# EAGLE design BioSignalPi-VersionA (EAGLE 7.2.0)
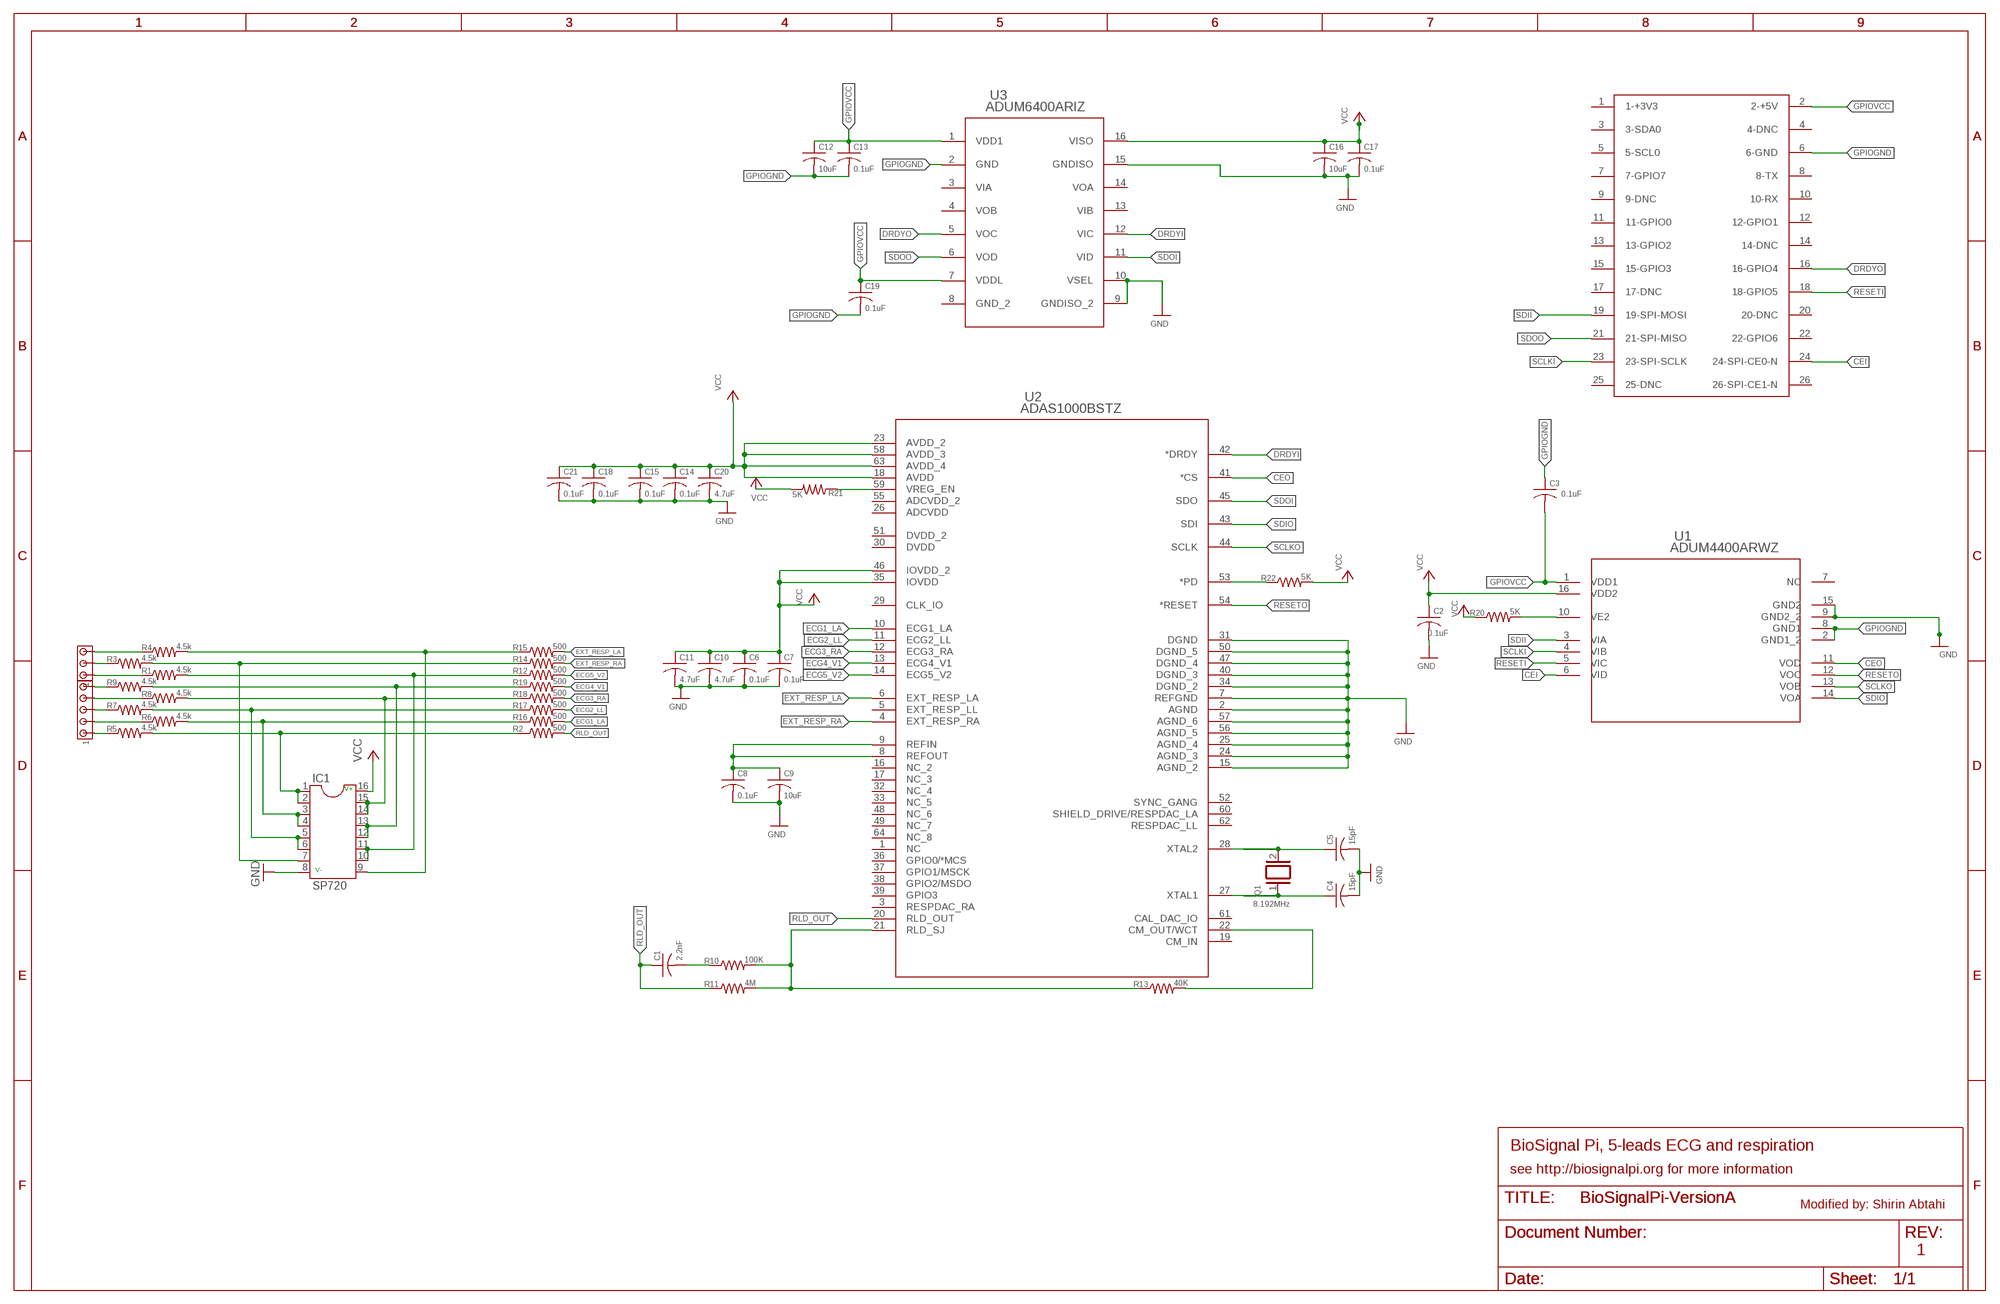
[diagram p0: schematic, sheet 1]

## Parts
C1  2.2nF  C-USC0805  [C0805]
C2  0.1uF  C-USC0805  [C0805]
C3  0.1uF  C-USC0805  [C0805]
C4  15pF  C-USC0805  [C0805]
C5  15pF  C-USC0805  [C0805]
C6  0.1uF  C-USC0805  [C0805]
C7  0.1uF  C-USC0805  [C0805]
C8  0.1uF  C-USC0805  [C0805]
C9  10uF  C-USC0805  [C0805]
C10  4.7uF  C-USC0805  [C0805]
C11  4.7uF  C-USC0805  [C0805]
C12  10uF  C-USC0805  [C0805]
C13  0.1uF  C-USC0805  [C0805]
C14  0.1uF  C-USC0805  [C0805]
C15  0.1uF  C-USC0805  [C0805]
C16  10uF  C-USC0805  [C0805]
C17  0.1uF  C-USC0805  [C0805]
C18  0.1uF  C-USC0805  [C0805]
C19  0.1uF  C-USC0805  [C0805]
C20  4.7uF  C-USC0805  [C0805]
C21  0.1uF  C-USC0805  [C0805]
IC1  SP720  DIL16  [DIL16]
J1  JUMPERS  MTA03-100  [10X03MTA]
J2  JUMPERS  MTA05-100  [10X05MTA]
Q1  8.192MHz  XTAL/S  [QS]
R1  4.5k  R-US_R0805  [R0805]
R2  500  R-US_R0805  [R0805]
R3  4.5k  R-US_R0805  [R0805]
R4  4.5k  R-US_R0805  [R0805]
R5  4.5k  R-US_R0805  [R0805]
R6  4.5k  R-US_R0805  [R0805]
R7  4.5k  R-US_R0805  [R0805]
R8  4.5k  R-US_R0805  [R0805]
R9  4.5k  R-US_R0805  [R0805]
R10  100K  R-US_R0805  [R0805]
R11  4M  R-US_R0805  [R0805]
R12  500  R-US_R0805  [R0805]
R13  40K  R-US_R0805  [R0805]
R14  500  R-US_R0805  [R0805]
R15  500  R-US_R0805  [R0805]
R16  500  R-US_R0805  [R0805]
R17  500  R-US_R0805  [R0805]
R18  500  R-US_R0805  [R0805]
R19  500  R-US_R0805  [R0805]
R20  5K  R-US_R0805  [R0805]
R21  5K  R-US_R0805  [R0805]
R22  5K  R-US_R0805  [R0805]
U1  ADUM4400ARWZ  [RW_16]
U2  ADAS1000BSTZ  [ST_64_2]
U3  ADUM6400ARIZ  [RI_16_1]
U$1  RASPBERRY-PI  [RASPBERRY-PI]

## Nets
CEI: U1.6(VID) U$1.24(24-SPI-CE0-N)
CEO: U1.11(VOD) U2.41(*CS)
DRDYI: U2.42(*DRDY) U3.12(VIC)
DRDYO: U3.5(VOC) U$1.16(16-GPIO4)
ECG1_LA: R16.2 U2.10(ECG1_LA)
ECG2_LL: R17.2 U2.11(ECG2_LL)
ECG3_RA: R18.2 U2.12(ECG3_RA)
ECG4_V1: R19.2 U2.13(ECG4_V1)
ECG5_V2: R12.2 U2.14(ECG5_V2)
EXT_RESP_LA: R15.2 U2.6(EXT_RESP_LA)
EXT_RESP_RA: R14.2 U2.4(EXT_RESP_RA)
GND: C2.2 C4.2 C5.2 C6.2 C7.2 C8.2 C9.2 C10.2 C11.2 C14.2 C15.2 C16.2 C17.2 C18.2 C20.2 C21.2 IC1.8 U1.9(GND2_2) U1.15(GND2) U2.2(AGND) U2.7(REFGND) U2.15(AGND_2) U2.24(AGND_3) U2.25(AGND_4) U2.31(DGND) U2.34(DGND_2) U2.40(DGND_3) U2.47(DGND_4) U2.50(DGND_5) U2.56(AGND_5) U2.57(AGND_6) U3.9(GNDISO_2) U3.10(VSEL) U3.15(GNDISO)
GPIOGND: C3.1 C12.2 C13.2 C19.2 U1.2(GND1_2) U1.8(GND1) U3.2(GND) U$1.6(6-GND)
GPIOVCC: C3.2 C12.1 C13.1 C19.1 U1.1(VDD1) U3.1(VDD1) U3.7(VDDL) U$1.2(2-+5V)
JUMPERS: J1.1 R1.1
N$1: J2.1 R5.1
N$2: J2.2 R6.1
N$3: J2.3 R7.1
N$4: J2.4 R8.1
N$5: J2.5 R9.1
N$7: J1.2 R3.1
N$8: J1.3 R4.1
N$9: IC1.9 R4.2 R15.1
N$10: IC1.7 R3.2 R14.1
N$11: C5.1 Q1.2 U2.28(XTAL2)
N$12: C4.1 Q1.1 U2.27(XTAL1)
N$13: R10.2 R11.2 R13.1 U2.21(RLD_SJ)
N$14: IC1.1 IC1.2 R2.1 R5.2
N$15: IC1.14 IC1.15 R8.2 R18.1
N$16: IC1.12 IC1.13 R9.2 R19.1
N$17: IC1.3 IC1.4 R6.2 R16.1
N$18: IC1.5 IC1.6 R7.2 R17.1
N$19: IC1.10 IC1.11 R1.2 R12.1
N$21: R20.2 U1.10(VE2)
N$23: R22.1 U2.53(*PD)
N$25: R13.2 U2.22(CM_OUT/WCT)
N$26: C1.2 R10.1
N$29: R21.1 U2.59(VREG_EN)
N$36: C8.1 C9.1 U2.8(REFOUT) U2.9(REFIN)
RESETI: U1.5(VIC) U$1.18(18-GPIO5)
RESETO: U1.12(VOC) U2.54(*RESET)
RLD_OUT: C1.1 R2.2 R11.1 U2.20(RLD_OUT)
SCLKI: U1.4(VIB) U$1.23(23-SPI-SCLK)
SCLKO: U1.13(VOB) U2.44(SCLK)
SDII: U1.3(VIA) U$1.19(19-SPI-MOSI)
SDIO: U1.14(VOA) U2.43(SDI)
SDOI: U2.45(SDO) U3.11(VID)
SDOO: U3.6(VOD) U$1.21(21-SPI-MISO)
VCC: C2.1 C6.1 C7.1 C10.1 C11.1 C14.1 C15.1 C16.1 C17.1 C18.1 C20.1 C21.1 IC1.16 R20.1 R21.2 R22.2 U1.16(VDD2) U2.18(AVDD) U2.23(AVDD_2) U2.35(IOVDD) U2.46(IOVDD_2) U2.58(AVDD_3) U2.63(AVDD_4) U3.16(VISO)
Unconnected: U1.7(NC) U2.1(NC) U2.3(RESPDAC_RA) U2.5(EXT_RESP_LL) U2.16(NC_2) U2.17(NC_3) U2.19(CM_IN) U2.26(ADCVDD) U2.29(CLK_IO) U2.30(DVDD) U2.32(NC_4) U2.33(NC_5) U2.36(GPIO0/*MCS) U2.37(GPIO1/MSCK) U2.38(GPIO2/MSDO) U2.39(GPIO3) U2.48(NC_6) U2.49(NC_7) U2.51(DVDD_2) U2.52(SYNC_GANG) U2.55(ADCVDD_2) U2.60(SHIELD_DRIVE/RESPDAC_LA) U2.61(CAL_DAC_IO) U2.62(RESPDAC_LL) U2.64(NC_8) U3.3(VIA) U3.4(VOB) U3.8(GND_2) U3.13(VIB) U3.14(VOA) U$1.1(1-+3V3) U$1.3(3-SDA0) U$1.4(4-DNC) U$1.5(5-SCL0) U$1.7(7-GPIO7) U$1.8(8-TX) U$1.9(9-DNC) U$1.10(10-RX) U$1.11(11-GPIO0) U$1.12(12-GPIO1) U$1.13(13-GPIO2) U$1.14(14-DNC) U$1.15(15-GPIO3) U$1.17(17-DNC) U$1.20(20-DNC) U$1.22(22-GPIO6) U$1.25(25-DNC) U$1.26(26-SPI-CE1-N)

## Notes on the sheet
- V+
- V-
- BioSignal Pi, 5-leads ECG and respiration
- see http://biosignalpi.org for more information
- Modified by: Shirin Abtahi
- 1

## Library data of the parts
C1-C21 = rcl:C-US: CAPACITOR, American symbol
IC1 = ic-packageEdit:DIL16: Dual In Line / Socket
J1 = con-amp:MTA03-100: AMP connector
J2 = con-amp:MTA05-100: AMP connector
Q1 = special:XTAL/S: CRYSTAL
R1-R22 = adafruit:R-US_: RESISTOR, American symbol
U1 = ADUM4400:ADUM4400ARWZ
U2 = ADAS1000:ADAS1000BSTZ
U3 = adum6403:ADUM6400ARIZ
U$1 = RaspberryPiEdit:RASPBERRY-PI: Raspberry Pi Board <http://www.raspberrypi.org/> Jacques Lagnel V1.0 (beta) 2012 Board dimension: Forum 3D model <http://www.raspberrypi.org/forum/general-discussion/mechanical-profile-3d-models?value=3d%20model&type=1&include=1&search=1&ret=all> The GPIO Connector (P1): http://elinux.org/RPi_Low-level_peripherals

## Board
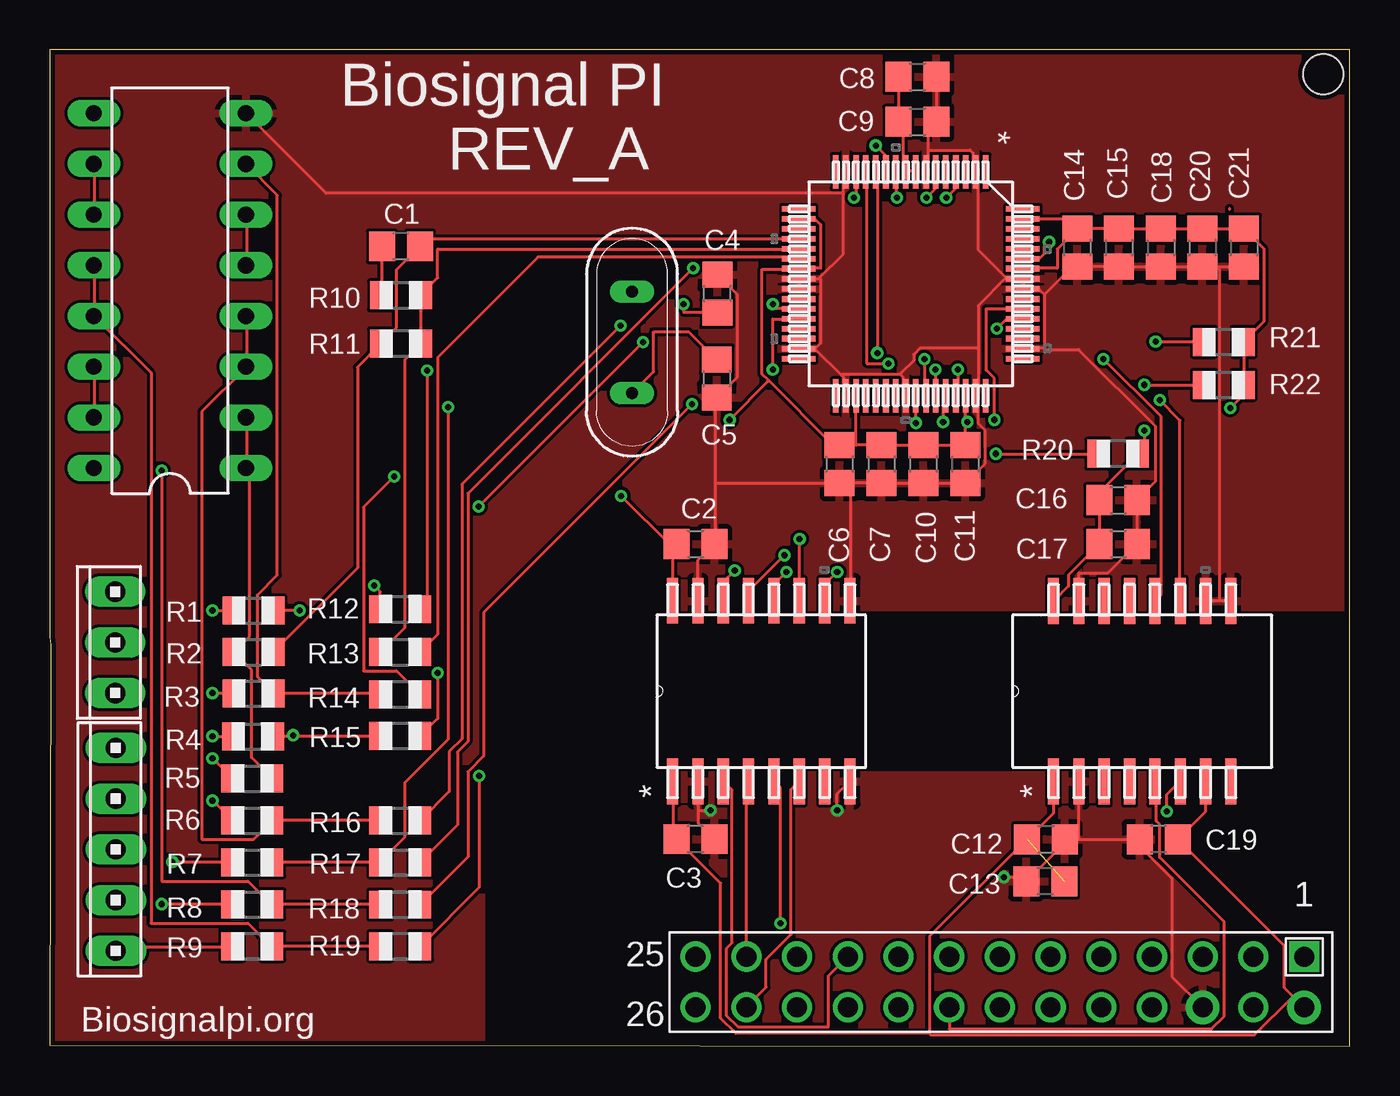
[diagram p1: board, top side]
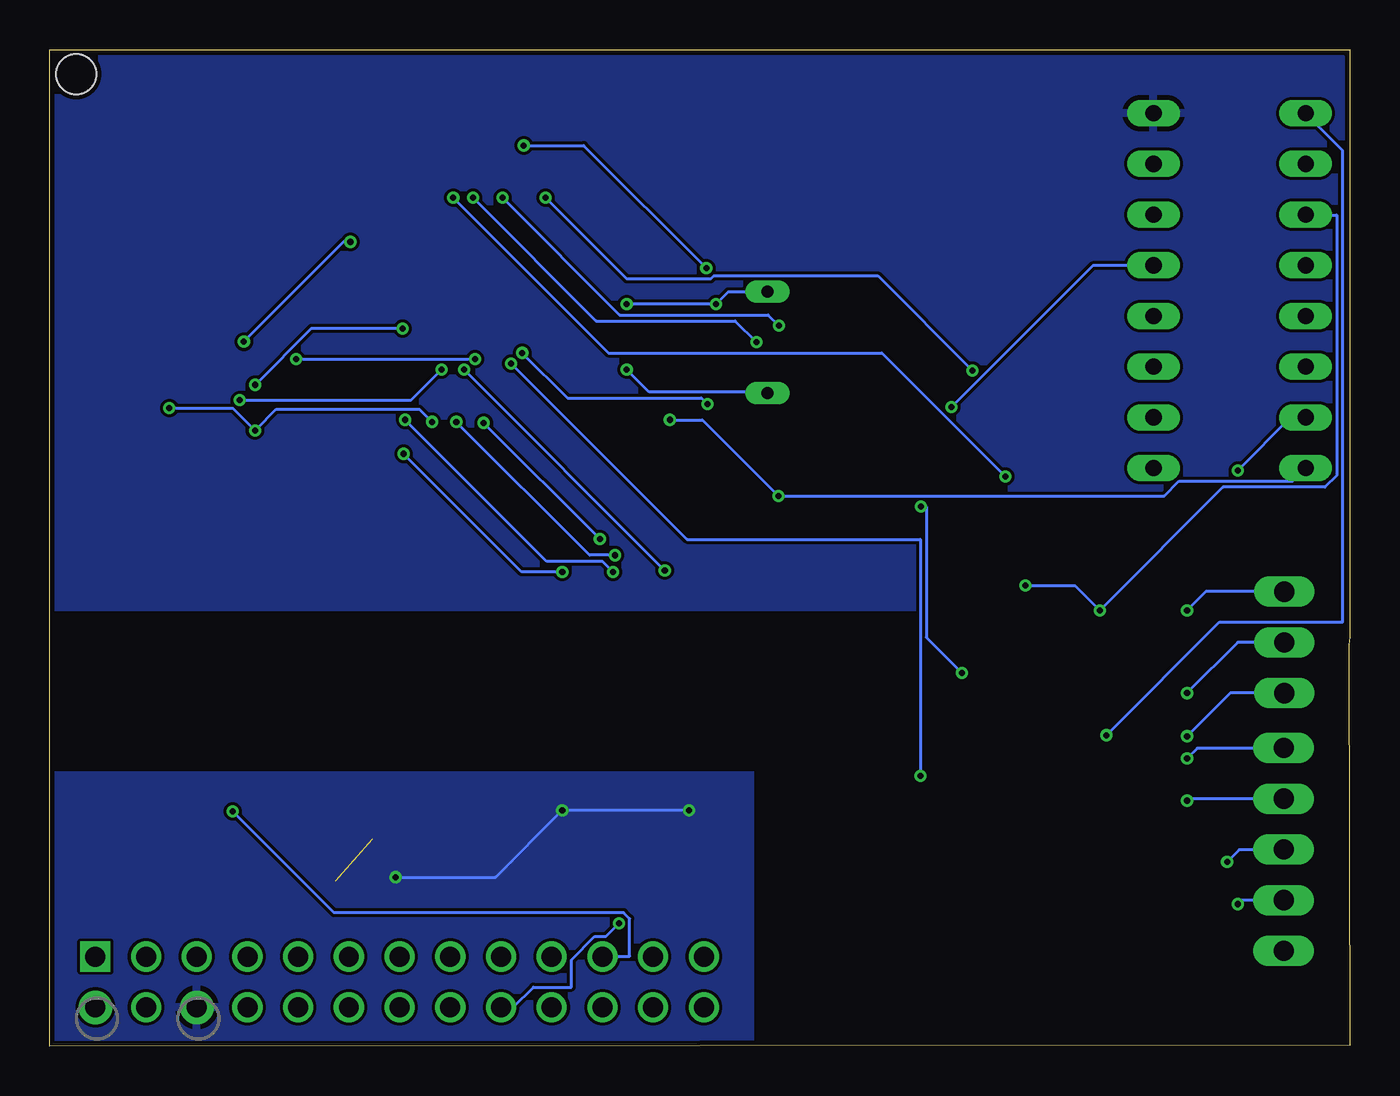
[diagram p2: board, bottom side, seen from below]

Size 65.1 x 49.9 mm. Coordinates in mm from the lower left corner, seen from the top.
Outline: 0,0.03 65.1,0 65.1,49.9 0,49.9 0,20.5 0.04,20.09 0,0.03
Copper layers (1*16): Top 0.035mm / dielectric 1.5mm / Bottom 0.035mm
Design rules "ITEADstudio_DRC": minimum track width 6mil, minimum drill 12mil, track to track 6mil, track to pad 6mil, pad to pad 6mil, via to via 6mil, smd to smd 0mil, copper to edge 10mil, drill to drill 10mil, minimum pad ring 10mil, minimum via ring 6mil, stop-mask expansion 2mil, vias tented up to drill 100mil, thermal gap 10mil
Holes 2 mm at 63.78,48.69
tRestrict: area 22,14 to 65.4,21.6; area 22,0 to 29.6,14
bRestrict: area 22,14 to 65.2,21.6; area 22,0 to 29.6,14

### Footprints (pad centres in the part's own frame; a part is rotated, then mirrored left to right if it is on the bottom)
C0805 = smd 1.3 x 1.5: 1 -0.95,0; 2 0.95,0
DIL16 = drill 0.813 long: 1 -8.89,-3.81; 2 -6.35,-3.81; 3 -3.81,-3.81; 4 -1.27,-3.81; 5 1.27,-3.81; 6 3.81,-3.81; 7 6.35,-3.81; 8 8.89,-3.81; 9 8.89,3.81; 10 6.35,3.81; 11 3.81,3.81; 12 1.27,3.81; 13 -1.27,3.81; 14 -3.81,3.81; 15 -6.35,3.81; 16 -8.89,3.81
10X03MTA = drill 1.016 long: 1 2.54,0; 2 0,0; 3 -2.54,0
10X05MTA = drill 1.016 long: 1 5.08,0; 2 2.54,0; 3 0,0; 4 -2.54,0; 5 -5.08,0
QS = drill 0.61 long: 1 -2.54,0; 2 2.54,0
R0805 = smd 1.1 x 1.4: 1 -1,0; 2 1,0
RW_16 = smd 2.286 x 0.559: 1 -4.521,4.445; 2 -4.521,3.175; 3 -4.521,1.905; 4 -4.521,0.635; 5 -4.521,-0.635; 6 -4.521,-1.905; 7 -4.521,-3.175; 8 -4.521,-4.445; 9 4.521,-4.445; 10 4.521,-3.175; 11 4.521,-1.905; 12 4.521,-0.635; 13 4.521,0.635; 14 4.521,1.905; 15 4.521,3.175; 16 4.521,4.445
ST_64_2 = smd 1.676 x 0.279: 1 -5.613,3.759; 2 -5.613,3.251; 3 -5.613,2.743; 4 -5.613,2.261; 5 -5.613,1.753; 6 -5.613,1.245; 7 -5.613,0.762; 8 -5.613,0.254; 9 -5.613,-0.254; 10 -5.613,-0.762; 11 -5.613,-1.245; 12 -5.613,-1.753; 13 -5.613,-2.261; 14 -5.613,-2.743; 15 -5.613,-3.251; 16 -5.613,-3.759; 33 5.613,-3.759; 34 5.613,-3.251; 35 5.613,-2.743; 36 5.613,-2.261; 37 5.613,-1.753; 38 5.613,-1.245; 39 5.613,-0.762; 40 5.613,-0.254; 41 5.613,0.254; 42 5.613,0.762; 43 5.613,1.245; 44 5.613,1.753; 45 5.613,2.261; 46 5.613,2.743; 47 5.613,3.251; 48 5.613,3.759 | smd 0.279 x 1.676: 17 -3.759,-5.613; 18 -3.251,-5.613; 19 -2.743,-5.613; 20 -2.261,-5.613; 21 -1.753,-5.613; 22 -1.245,-5.613; 23 -0.762,-5.613; 24 -0.254,-5.613; 25 0.254,-5.613; 26 0.762,-5.613; 27 1.245,-5.613; 28 1.753,-5.613; 29 2.261,-5.613; 30 2.743,-5.613; 31 3.251,-5.613; 32 3.759,-5.613; 49 3.759,5.613; 50 3.251,5.613; 51 2.743,5.613; 52 2.261,5.613; 53 1.753,5.613; 54 1.245,5.613; 55 0.762,5.613; 56 0.254,5.613; 57 -0.254,5.613; 58 -0.762,5.613; 59 -1.245,5.613; 60 -1.753,5.613; 61 -2.261,5.613; 62 -2.743,5.613; 63 -3.251,5.613; 64 -3.759,5.613
RI_16_1 = smd 2.311 x 0.559: 1 -4.521,4.445; 2 -4.521,3.175; 3 -4.521,1.905; 4 -4.521,0.635; 5 -4.521,-0.635; 6 -4.521,-1.905; 7 -4.521,-3.175; 8 -4.521,-4.445; 9 4.521,-4.445; 10 4.521,-3.175; 11 4.521,-1.905; 12 4.521,-0.635; 13 4.521,0.635; 14 4.521,1.905; 15 4.521,3.175; 16 4.521,4.445
RASPBERRY-PI = drill 1 square: 1 0,0 | drill 1 pad 1.676: 2 0,2.54; 6 5.08,2.54 | drill 1: 3 2.54,0; 4 2.54,2.54; 5 5.08,0; 7 7.62,0; 8 7.62,2.54; 9 10.16,0; 10 10.16,2.54; 11 12.7,0; 12 12.7,2.54; 13 15.24,0; 14 15.24,2.54; 15 17.78,0; 16 17.78,2.54; 17 20.32,0; 18 20.32,2.54; 19 22.86,0; 20 22.86,2.54; 21 25.4,0; 22 25.4,2.54; 23 27.94,0; 24 27.94,2.54; 25 30.48,0; 26 30.48,2.54

### Placement (x,y rotation side)
C1  17.58,40.06 180 top
C2  32.34,25.15 0 top
C3  32.34,10.37 180 top
C4  33.43,37.69 90 top
C5  33.4,33.44 270 top
C6  39.55,29.15 270 top
C7  41.65,29.15 270 top
C8  43.45,48.55 0 top
C9  43.45,46.3 0 top
C10  43.75,29.15 270 top
C11  45.85,29.15 270 top
C12  49.89,10.36 0 top
C13  49.86,8.25 180 top
C14  51.46,40 270 top
C15  53.55,40 270 top
C16  53.51,27.35 0 top
C17  53.51,25.15 0 top
C18  55.65,40 270 top
C19  55.54,10.36 180 top
C20  57.73,40 270 top
C21  59.81,40 270 top
IC1  6.01,37.84 90 top
J1  3.27,20.22 90 top
J2  3.3,9.85 90 top
Q1  29.16,35.25 270 top
R1  10.2,21.82 0 top
R2  10.2,19.74 0 top
R3  10.2,17.66 0 top
R4  10.17,15.51 0 top
R5  10.14,13.4 0 top
R6  10.14,11.3 0 top
R7  10.14,9.2 0 top
R8  10.14,7.1 0 top
R9  10.14,5 0 top
R10  17.58,37.61 0 top
R11  17.58,35.19 0 top
R12  17.55,21.88 0 top
R13  17.55,19.74 0 top
R14  17.55,17.62 0 top
R15  17.55,15.54 0 top
R16  17.55,11.3 0 top
R17  17.55,9.2 0 top
R18  17.55,7.08 0 top
R19  17.55,5 0 top
R20  53.51,29.67 180 top
R21  58.8,35.27 0 top
R22  58.8,33.12 0 top
U1  35.63,17.78 90 top
U2  43.12,38.18 270 top
U3  54.71,17.78 90 top
U$1  62.82,4.48 180 top

### Tracks (layer width: path | path; a pad name or v marks a point on that pad's centre or on a via)
CEI
  Top 0.152: U1.6 37.12,12.85 37.12,5.59 35.88,4.34 35.88,2.95 34.89,1.96 U$1.24
CEO  (via drill 0.3)
  Top 0.152: v43.37,31.22 U2.41 | v37.55,25.4 37.55,22.3 U1.11
  Bottom 0.152: v37.55,25.4 v43.37,31.22
DRDYI  (via drill 0.3)
  Top 0.152: v43.8,34.42 43.8,32.66 43.88,32.59 U2.42 | v52.77,34.42 55.66,31.52 55.66,22.61 U3.12
  Bottom 0.152: v52.77,34.42 v43.8,34.42
DRDYO
  Top 0.152: U3.5 55.41,13.21 55.41,11.28 55.59,11.1 55.59,9.45 58.82,6.22 58.82,1.5 58.18,0.86 45.05,0.86 U$1.16
ECG1_LA  (via drill 0.3)
  Top 0.152: v28.59,36.09 20.64,28.14 20.64,15.39 20,14.76 20,12.75 R16.2 | v42.43,42.49 42.38,42.55 42.38,43.79 U2.10
  Bottom 0.152: v28.59,36.09 29.12,36.63 36.56,36.63 v42.43,42.49
ECG2_LL  (via drill 0.3)
  Top 0.152: v32.22,38.96 20.94,27.69 20.94,15.27 20.41,14.73 20.41,11.07 18.56,9.22 R17.2 | v41.37,45.11 41.87,44.6 41.87,43.81 U2.11
  Bottom 0.152: v32.22,38.96 38.37,45.11 v41.37,45.11
ECG3_RA  (via drill 0.3)
  Top 0.152: v32.17,32.16 21.73,21.72 21.73,14.53 20.94,13.74 20.94,9.47 R18.2 | v41.44,34.72 41.44,43.74 41.39,43.79 U2.12
  Bottom 0.152: v32.17,32.16 32.48,32.46 39.18,32.46 v41.44,34.72
ECG4_V1  (via drill 0.3)
  Top 0.152: v21.5,13.54 21.5,7.95 R19.2 | v42,34.19 40.91,34.19 40.91,43.76 40.88,43.79 U2.13
  Bottom 0.152: v21.5,13.54 21.5,25.38 33.19,25.38 v42,34.19
ECG5_V2  (via drill 0.3)
  Top 0.152: v18.89,33.83 18.89,22.23 18.56,21.89 R12.2 | v40.27,42.49 40.37,42.6 U2.14
  Bottom 0.152: v18.89,33.83 23.64,38.58 31.84,38.58 31.99,38.43 36.21,38.43 v40.27,42.49
EXT_RESP_LA  (via drill 0.3)
  Top 0.152: v19.42,18.69 19.42,16.41 R15.2 | v29.71,35.26 v21.48,27.03 | v43.91,42.49 44.36,42.95 U2.6
  Bottom 0.152: v19.42,18.69 21.2,20.47 21.2,27.03 v21.48,27.03 | v29.71,35.26 30.77,36.32 37.73,36.32 v43.91,42.49
EXT_RESP_RA  (via drill 0.3)
  Top 0.152: v17.23,28.52 15.71,27 15.71,18.8 17.36,18.8 18.53,17.63 R14.2 | v44.9,42.49 45.38,42.98 U2.4
  Bottom 0.152: v17.23,28.52 23.43,34.72 37.12,34.72 v44.9,42.49
GND
  Top 0.152: 38.32,34.92 39.64,33.6 | 39.64,33.6 39.74,33.5 39.74,32.72 39.87,32.59 U2.34 | 38.32,34.92 37.53,34.92 U2.31 | 42.58,33.66 42.74,33.5 42.74,32.72 42.86,32.59 U2.40 | 42.58,33.66 39.69,33.66 39.64,33.6 | U2.25 37.53,37.95 37.53,38.43 U2.24 37.61,38.43 38.5,38.43 38.55,38.48 | 39.74,42.72 39.74,39.67 38.55,38.48 | 39.74,42.72 39.74,43.66 U2.15 | IC1.8 9.84,46.71 13.83,42.72 39.69,42.72 39.74,42.72 | 38.32,34.92 38.37,34.98 38.6,35.2 38.6,38.43 38.55,38.48 | C6.2 C7.2 41.72,28.19 43.73,28.19 C10.2 43.83,28.19 45.84,28.19 C11.2 45.91,28.25 46.85,29.18 46.85,30.84 46.5,31.19 46.5,32.46 46.39,32.56 U2.47 46.39,32.64 46.5,32.74 46.5,34.95 | U1.9 40.09,22.3 40.09,28.14 C6.2 | U1.15 32.48,22.3 32.48,24.36 33.26,25.15 C2.2 33.34,25.2 33.34,28.19 | 33.34,28.19 33.34,32.44 C5.2 33.47,32.54 34.43,33.5 34.43,37.64 C4.2 | C6.2 39.48,28.19 33.39,28.19 33.34,28.19 | U3.15 51.55,23.7 53,23.7 54.4,25.09 C17.2 54.45,25.15 54.45,27.33 C16.2 54.5,27.41 55.36,28.27 55.36,31.06 51.52,34.9 49.87,34.9 49.82,34.95 | C8.2 44.41,48.54 44.41,46.3 C9.2 44.34,46.25 43.98,45.9 43.98,44.88 | 43.98,44.88 43.98,43.89 43.91,43.81 U2.7 | 43.98,44.88 44.03,44.88 46.09,44.88 46.24,44.73 46.24,43.94 46.37,43.81 U2.2 46.42,43.74 46.5,43.66 46.5,39.88 47.89,38.48 | 49.82,34.95 48.76,34.95 U2.50 | 49.82,37.64 49.82,34.95 | 49.82,37.64 49.54,37.92 48.76,37.92 U2.56 48.76,38 48.76,38.43 U2.57 48.68,38.48 47.89,38.48 | 58.59,22.3 59.15,22.3 U3.9 | 58.59,22.3 U3.10 | 58.59,39.04 57.8,39.04 C20.2 55.72,39.04 C18.2 53.61,39.04 C15.2 53.53,39.04 51.47,39.04 C14.2 51.4,39.01 51.2,39.01 49.87,37.69 49.82,37.64
  Top 0.152: 58.59,39.04 C21.2 | 58.59,22.3 58.59,22.35 58.59,38.99 58.59,39.04 | 46.5,34.95 46.5,37.08 47.84,38.43 47.89,38.48 | 42.58,33.66 42.63,33.71 43.27,34.34 43.27,34.65 43.58,34.95 46.45,34.95 46.5,34.95
  pour Bottom: 65.19,49.53 0.42,49.53 0.42,0 22.01,0 22.01,21.59 65.19,21.59
  pour Top: 65.19,49.53 65.19,21.59 22.01,21.59 22.01,0 -0.85,0 -0.85,49.53
GPIOGND  (via drill 0.3)
  Top 0.152: 32.48,11.81 32.48,13.26 U1.2 | 32.48,11.81 32.48,11.18 33.26,10.39 C3.1 | v39.43,11.81 39.43,12.62 U1.8 | v33.08,11.81 32.53,11.81 32.48,11.81 | 51.55,10.36 50.89,10.36 C12.2 50.81,10.36 50.81,10.16 C13.2 49.01,8.46 v47.79,8.46 | 51.55,10.36 54.57,10.36 C19.2 54.62,10.31 54.62,9.98 56.2,8.41 56.2,3.48 57.72,1.96 U$1.6 | U3.2 51.55,10.41 51.55,10.36
  Bottom 0.152: v33.08,11.81 v39.43,11.81 39.48,11.76 42.79,8.46 v47.79,8.46
  pour Bottom: 65.19,13.97 29.63,13.97 29.63,0 65.19,0
  pour Top: 66.46,0 66.46,13.97 29.63,13.97 29.63,12.7 29.63,0
GPIOVCC  (1 unrouted)
  Top 0.152: U3.7 57.88,13.26 57.88,11.73 56.5,10.36 C19.1 56.55,10.31 61.84,5.03 61.84,2.92 62.8,1.96 U$1.2 62.22,2.44 60.34,0.56 44.11,0.56 44.11,0.58 44.06,0.64 | U1.1 31.2,13.26 31.2,10.57 31.38,10.39 C3.2 31.43,10.31 33.59,8.15 33.59,1.4 34.35,0.64 44.06,0.64 | U3.1 50.26,13.26 50.26,11.66 48.96,10.36 C12.1 48.88,10.31 44.06,5.49 44.06,0.64
JUMPERS  (via drill 0.3)
  Top 0.152: v8.14,21.82 9.18,21.82 R1.1
  Bottom 0.152: v8.14,21.82 7.2,22.76 3.29,22.76 J1.1
N$1  (via drill 0.3)
  Top 0.152: v8.14,14.4 R5.1
  Bottom 0.152: v8.14,14.4 7.63,14.91 3.32,14.91 J2.1
N$2  (via drill 0.3)
  Top 0.152: v8.14,12.29 R6.1
  Bottom 0.152: v8.14,12.29 8.07,12.37 3.32,12.37 J2.2
N$3  (via drill 0.3)
  Top 0.152: v6.14,9.22 9.13,9.22 R7.1
  Bottom 0.152: v6.14,9.22 5.53,9.83 3.32,9.83 J2.3
N$4  (via drill 0.3)
  Top 0.152: v5.6,7.11 9.13,7.11 R8.1
  Bottom 0.152: v5.6,7.11 5.42,7.29 3.32,7.29 J2.4
N$5
  Top 0.152: R9.1 9.13,4.98 3.32,4.98 3.32,4.78 J2.5
N$6
  Top 0.152: 59.1,41.9 59.1,41.96
N$7  (via drill 0.3)
  Top 0.152: v8.14,17.68 9.18,17.68 R3.1
  Bottom 0.152: v8.14,17.68 5.6,20.22 3.29,20.22 J1.2
N$8  (via drill 0.3)
  Top 0.152: v8.14,15.52 9.16,15.52 R4.1
  Bottom 0.152: v8.14,15.52 5.98,17.68 3.29,17.68 J1.3
N$9  (via drill 0.3)
  Top 0.152: 12.18,15.52 16.55,15.52 R15.1 | 12.18,15.52 11.19,15.52 R4.2 | v12.18,15.57 12.18,15.52
  Bottom 0.152: v12.18,15.57 6.52,21.23 0.34,21.23 0.34,44.86 2.2,46.71 IC1.9
N$10
  Top 0.152: R14.1 16.55,17.65 11.21,17.65 R3.2 11.16,17.73 10.4,18.49 10.4,22.61 11.39,23.6 11.39,42.62 9.84,44.17 IC1.7
N$11  (via drill 0.3)
  Top 0.152: C5.1 31.99,35.79 30.24,35.79 30.24,33.78 29.17,32.72 Q1.2 | v36.21,33.88 36.21,36.42 U2.28
  Bottom 0.152: v36.21,33.88 35.09,32.77 29.22,32.77 29.17,32.72 Q1.2
N$12  (via drill 0.3)
  Top 0.152: v31.74,37.16 31.74,36.75 33.41,36.75 C4.1 | v36.21,37.16 36.21,36.96 37.5,36.96 U2.27
  Bottom 0.152: Q1.1 29.17,37.77 31.13,37.77 v31.74,37.16 31.79,37.16 v36.21,37.16
N$13
  Top 0.152: R13.1 16.57,19.76 17.77,20.95 17.77,34.37 R11.2 18.58,35.26 18.58,37.59 R10.2 18.61,37.67 19.42,38.48 19.42,39.93 U2.21
N$14
  Top 0.152: IC1.2 9.84,31.47 9.84,28.96 IC1.1 9.84,28.88 10,28.73 10,20.52 9.26,19.79 R2.1 10.1,18.85 10.1,14.45 R5.2
N$15  (via drill 0.3)
  Top 0.152: R18.1 11.16,7.09 R8.2 11.06,7.11 9.92,8.26 5.6,8.26 v5.6,28.83 | IC1.15 2.22,31.5 2.22,34.01 IC1.14
  Bottom 0.152: v5.6,28.83 2.96,31.47 2.22,31.47 IC1.15
N$16
  Top 0.152: R19.1 11.16,5 R9.2 11.06,5 9.92,6.15 5.07,6.15 5.07,33.73 2.27,36.52 IC1.13 2.22,36.58 2.22,39.09 IC1.12
N$17
  Top 0.152: R16.1 11.16,11.3 R6.2 11.09,11.25 10.2,10.36 7.61,10.36 7.61,31.77 9.79,33.96 IC1.3 9.84,34.04 9.84,36.55 IC1.4
N$18  (via drill 0.3)
  Top 0.152: R7.2 11.16,9.2 R17.1 16.57,9.27 17.77,10.46 17.77,13.18 19.95,15.37 v19.95,32 | IC1.5 9.84,39.12 9.84,41.63 IC1.6
  Bottom 0.152: v19.95,32 12.87,39.09 9.84,39.09 IC1.5
N$19  (via drill 0.3)
  Top 0.152: v12.51,21.82 11.21,21.82 R1.2 | v16.24,23.06 16.55,22.76 16.55,21.89 R12.1 | IC1.11 2.22,41.66 2.22,44.17 IC1.10
  Bottom 0.152: v16.24,23.06 13.76,23.06 v12.51,21.82 12.46,21.87 6.34,27.99 1.23,27.99 0.65,28.57 0.65,41.63 2.2,41.63 IC1.11
N$21  (via drill 0.3)
  Top 0.152: v47.38,29.67 52.49,29.67 R20.2 | v39.43,23.75 38.83,23.14 38.83,22.3 U1.10
  Bottom 0.152: v47.38,29.67 41.47,23.75 v39.43,23.75
N$23  (via drill 0.3)
  Top 0.152: v54.83,33.12 R22.1 | v47.43,35.94 47.92,36.42 U2.53
  Bottom 0.152: v54.83,33.12 52.01,35.94 v47.43,35.94
N$25
  Top 0.152: R13.2 18.56,19.76 19.42,20.62 19.42,34.49 24.45,39.52 37.5,39.52 37.5,39.45 U2.22
N$26
  Top 0.152: R10.1 16.6,37.62 16.62,37.64 C1.2
N$29  (via drill 0.3)
  Top 0.152: v55.39,35.28 R21.1 | v50.05,40.28 49.82,40.06 49.82,39.7 49.57,39.45 48.76,39.45 U2.59
  Bottom 0.152: v55.39,35.28 50.38,40.28 v50.05,40.28
N$36
  Top 0.152: U2.8 43.37,43.81 42.89,43.81 U2.9 42.86,43.89 42.74,44.02 42.74,46.08 42.56,46.25 C9.1 C8.1
RESETI  (via drill 0.3)
  Top 0.152: v36.59,6.15 36.59,12.95 36.29,13.26 U1.5
  Bottom 0.152: v36.59,6.15 37.25,5.49 37.81,5.49 38.98,4.32 38.98,2.95 40.88,2.95 41.87,1.96 42.48,1.96 U$1.18
RESETO  (via drill 0.3)
  Top 0.152: v47.31,31.37 47.31,33.45 46.9,33.86 46.9,36.93 U2.54 | v36.89,23.75 36.29,23.14 36.29,22.3 U1.12
  Bottom 0.152: v47.31,31.37 40.22,24.28 37.43,24.28 v36.89,23.75
RLD_OUT
  Top 0.152: R2.2 11.21,19.76 15.41,23.95 15.41,34.01 R11.1 16.62,35.26 17.36,35.99 17.36,38.89 C1.1 18.56,40.13 18.56,40.44 U2.20
SCLKI
  Top 0.152: U1.4 34.89,13.16 34.89,4.5 U$1.23
SCLKO  (via drill 0.3)
  Top 0.152: v44.74,31.27 44.74,32.44 U2.44 | v36.79,24.59 35.02,22.81 35.02,22.3 U1.13
  Bottom 0.152: v44.74,31.27 38.06,24.59 v36.79,24.59
SDII
  Top 0.152: U1.3 33.75,13.26 34.18,12.83 34.18,5.18 33.9,4.9 33.9,1.52 34.48,0.94 38.98,0.94 38.98,3.5 39.94,4.47 U$1.19
SDIO  (via drill 0.3)
  Top 0.152: v44.36,33.88 44.36,32.59 U2.43 | v34.3,23.82 33.75,23.27 33.75,22.3 U1.14
  Bottom 0.152: v34.3,23.82 v44.36,33.88
SDOI  (via drill 0.3)
  Top 0.152: v45.48,33.88 45.48,32.66 45.4,32.59 U2.45 | v55.59,32.36 56.6,31.34 56.6,22.3 U3.11
  Bottom 0.152: v45.48,33.88 47,32.36 v55.59,32.36
SDOO  (via drill 0.3)
  Top 0.152: v55.94,11.76 55.94,12.6 56.6,13.26 U3.6
  Bottom 0.152: v55.94,11.76 50.86,6.68 36.36,6.68 36.06,6.38 36.06,4.5 37.4,4.5 U$1.21
VCC  (via drill 0.3)
  Top 0.152: U1.16 31.2,22.3 31.2,24.97 C2.1 31.15,25.02 v28.61,27.56 | U2.18 37.53,41.43 38.32,41.43 38.6,41.15 38.6,38.96 37.53,38.96 U2.23 37.45,38.91 35.68,38.91 35.68,33.66 36.01,33.33 | 40.37,30.1 C7.1 41.72,30.1 43.73,30.1 C10.1 43.8,30.1 45.84,30.1 C11.1 45.86,30.18 45.86,31.27 | 40.37,30.1 C6.1 39.48,30.12 39.21,30.12 36.01,33.33 | U2.35 40.37,30.15 40.37,30.1 | 45.86,31.27 U2.46 | U3.16 51.02,23.04 51.02,23.6 52.52,25.09 C17.1 52.57,27.28 C16.1 52.57,27.74 54.5,29.67 R20.1 54.52,29.74 54.83,30.05 v54.83,30.84 | C14.1 51.47,40.95 53.53,40.95 C15.1 53.61,40.95 C18.1 55.72,40.95 C20.1 57.8,40.95 C21.1 59.86,40.89 60.8,39.95 60.8,36.3 59.83,35.33 R21.2 59.8,35.26 R22.2 59.78,33.05 59.78,32.61 v59.12,31.95 | U2.58 48.76,38.96 50.46,38.96 50.46,39.93 51.42,40.89 C14.1 | U2.63 48.76,41.43 51.4,41.43 51.4,41 C14.1 | v45.96,31.27 45.91,31.27 45.86,31.27 | v34.05,31.37 35.95,33.27 36.01,33.33
  Bottom 0.152: IC1.16 2.22,28.93 2.86,28.3 8.55,28.3 9.29,27.56 v28.61,27.56 28.66,27.61 32.42,31.37 v34.05,31.37 | v59.12,31.95 55.94,31.95 v54.83,30.84 54.78,30.89 53.76,31.9 46.6,31.9 v45.96,31.27

### Text on the board
tPlace: Biosignal PI | REV_A | Biosignalpi.org